# Altium schematic sheet Sch.SchDoc
size A1
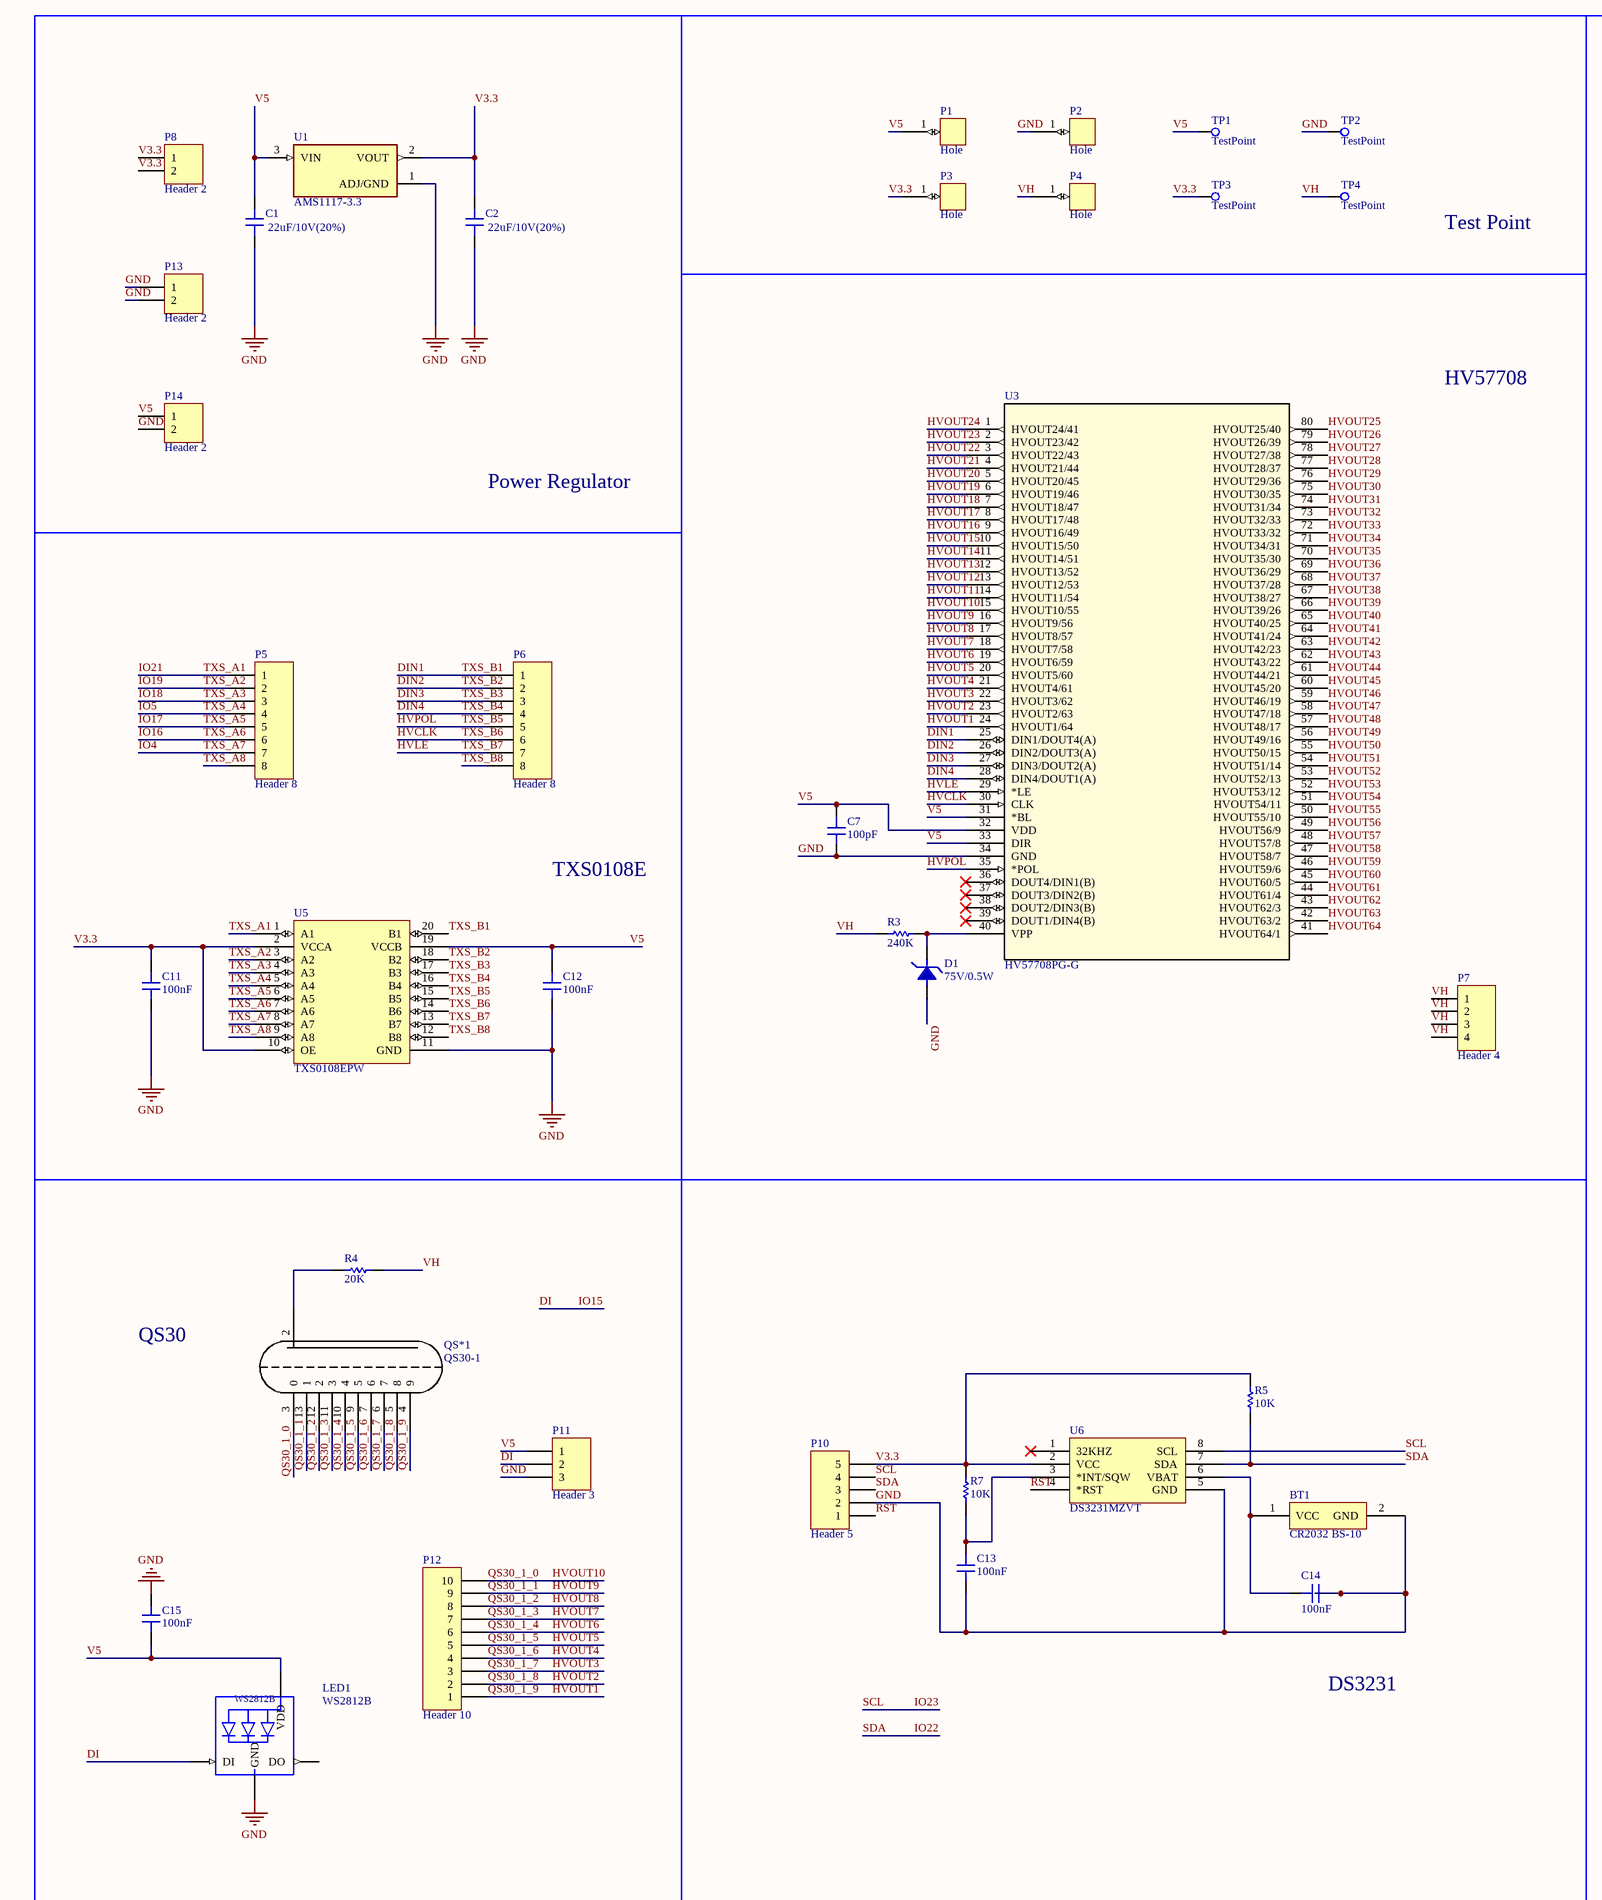
[diagram p0: Sch.SchDoc, left]
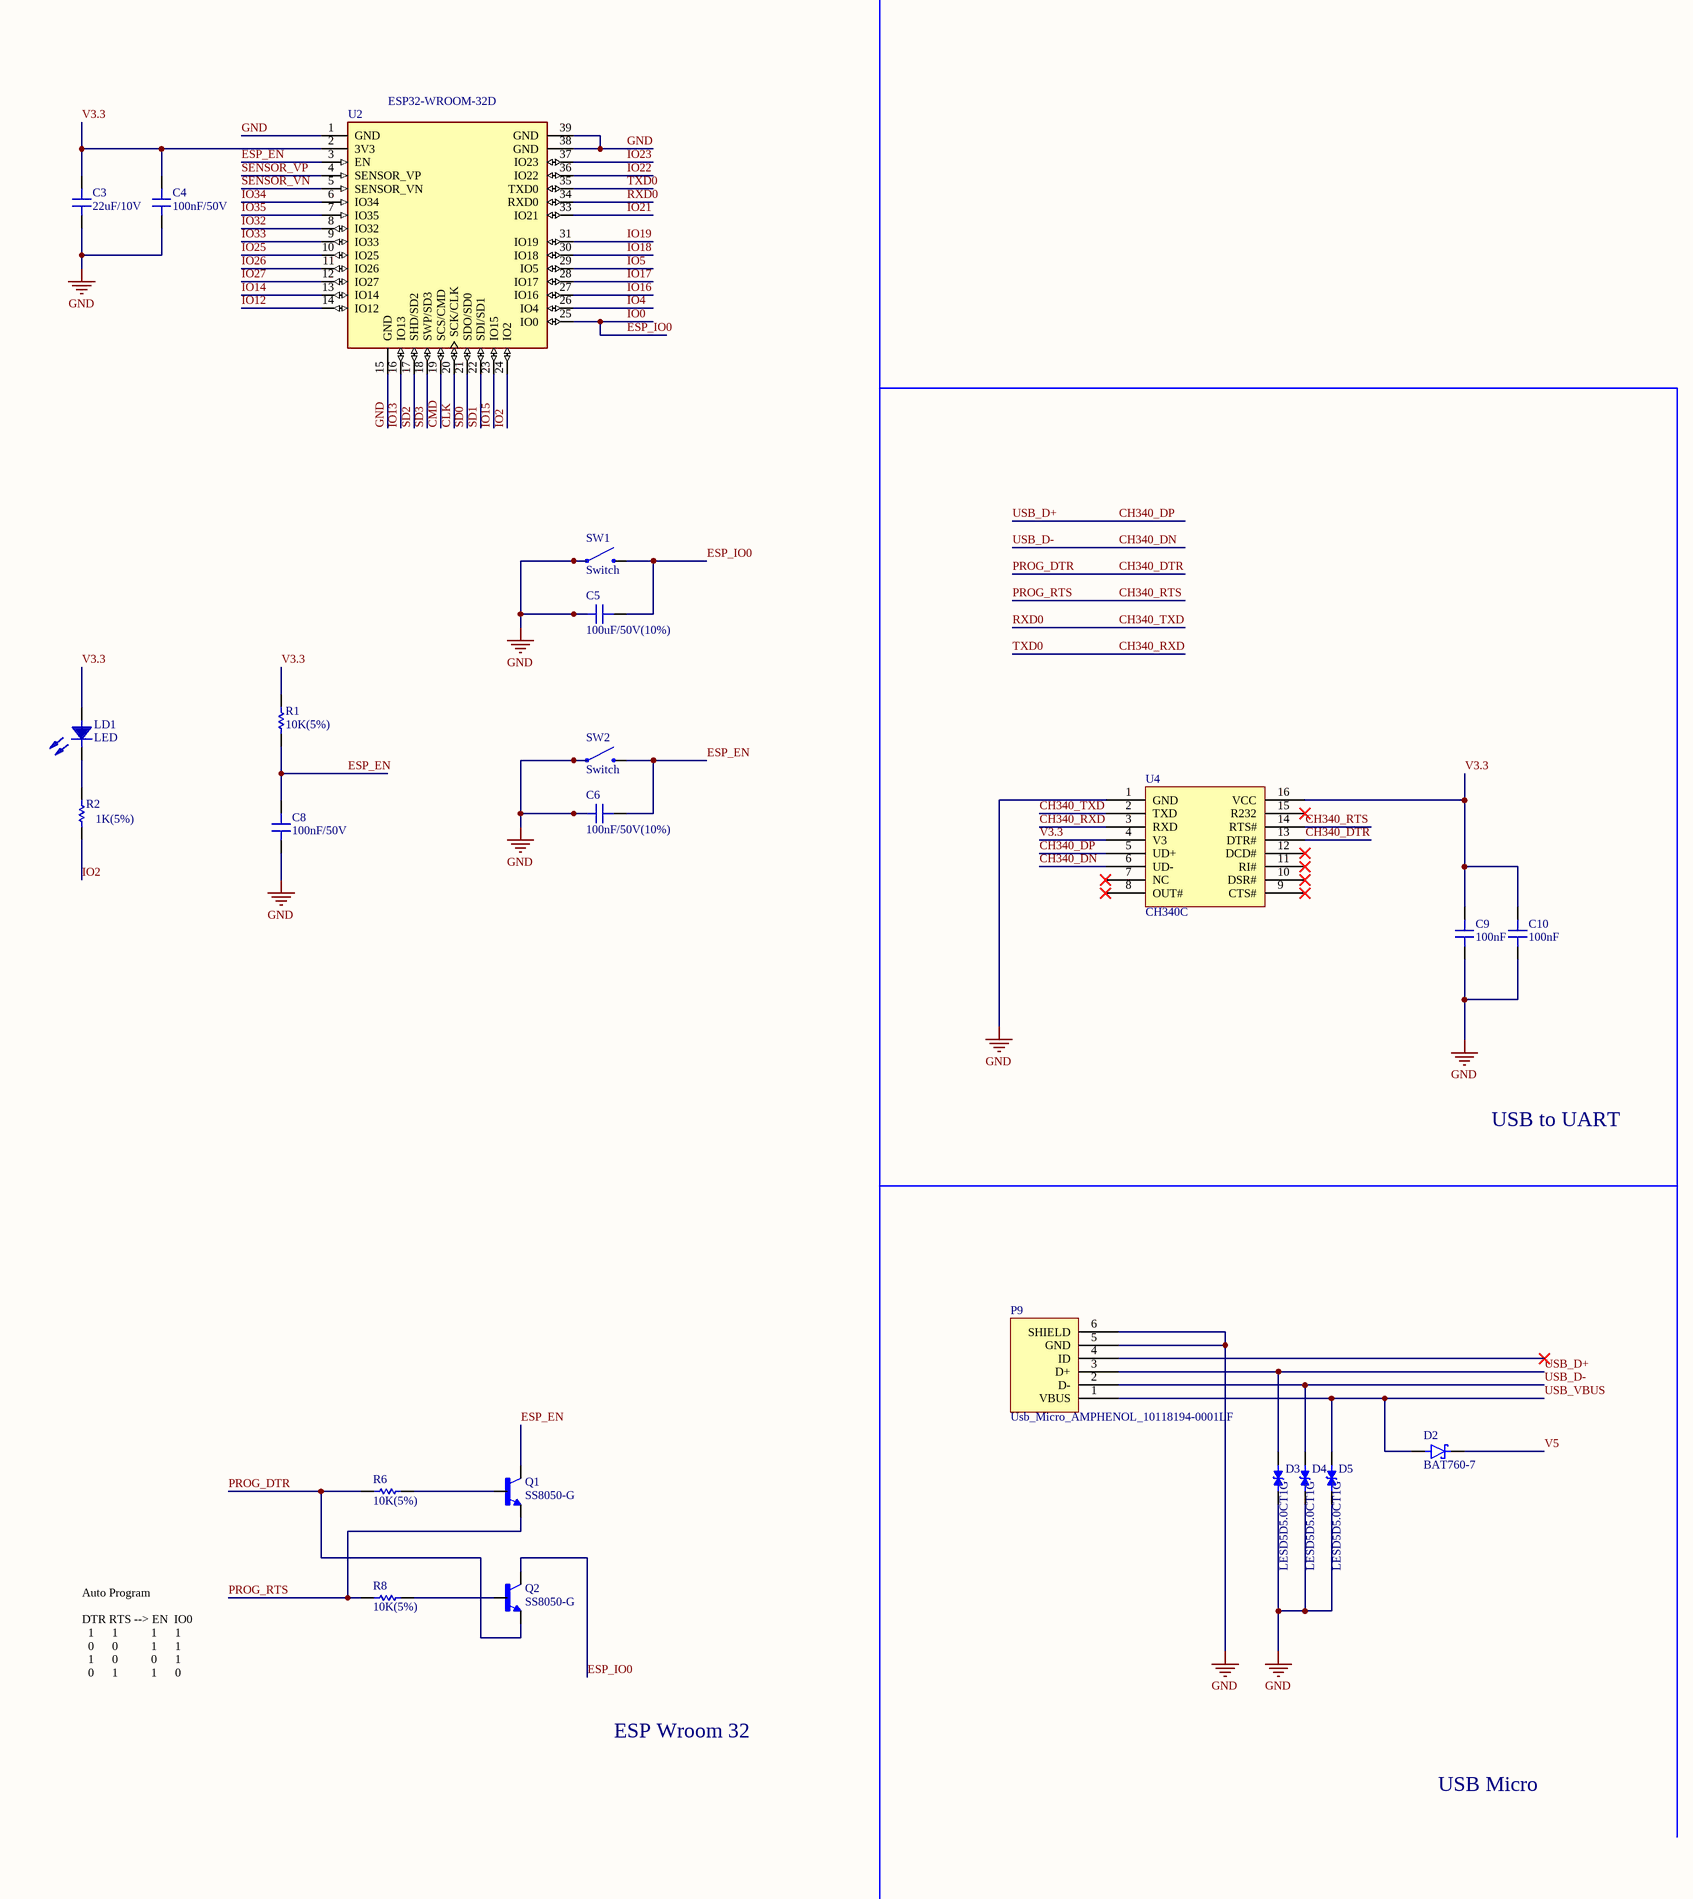
[diagram p1: Sch.SchDoc, right]

## Parts
BT1  CR2032 BS-10  [CR2032 BS-10]
C1  22uF/10V(20%)  [0805]
C2  22uF/10V(20%)  [0805]
C3  22uF/10V  [0805]
C4  100nF/50V  [0805]
C5  100uF/50V(10%)  [0805]
C6  100nF/50V(10%)  [0805]
C7  100pF  [0805]
C8  100nF/50V  [0805]
C9  100nF  [0805]
C10  100nF  [0805]
C11  100nF  [0805]
C12  100nF  [0805]
C13  100nF  [0805]
C14  100nF  [0805]
C15  100nF  [0805]
D1  75V/0.5W  [1206 Semiconductor]
D2  BAT760-7  [BAT760-7_SOD2513X120N]
D3  LESD5D5.0CT1G  [TVS_LESD5D5.0CT1G]
D4  LESD5D5.0CT1G  [TVS_LESD5D5.0CT1G]
D5  LESD5D5.0CT1G  [TVS_LESD5D5.0CT1G]
LD1  LED  [0805 Semiconductor]
LED1  WS2812B  [WS2812B]
P1  Hole  [HOLE_1M2]
P2  Hole  [HOLE_1M2]
P3  Hole  [HOLE_1M2]
P4  Hole  [HOLE_1M2]
P5  Header 8  [HDR1X8]
P6  Header 8  [HDR1X8]
P7  Header 4  [HDR1X4]
P8  Header 2  [HDR1X2]
P9  Usb_Micro_AMPHENOL_10118194-0001LF  [USB_MICRO_AMPHENOL_10118194-0001LF]
P10  Header 5  [HDR1X5]
P11  Header 3  [HDR1X3]
P12  Header 10  [HDR1X10]
P13  Header 2  [HDR1X2]
P14  Header 2  [HDR1X2]
Q1  SS8050-G  [TRANS_SS8050-G]
Q2  SS8050-G  [TRANS_SS8050-G]
QS*1  QS30-1  [QS30-1]
R1  10K(5%)  [0805]
R2  1K(5%)  [0805]
R3  240K  [0805]
R4  20K  [0805]
R5  10K  [0805]
R6  10K(5%)  [0805]
R7  10K  [0805]
R8  10K(5%)  [0805]
SW1  Switch  [2917]
SW2  Switch  [2917]
TP1  TestPoint  [Test-Point-SMD]
TP2  TestPoint  [Test-Point-SMD]
TP3  TestPoint  [Test-Point-SMD]
TP4  TestPoint  [Test-Point-SMD]
U1  AMS1117-3.3  [AMS1117_3V3_SOT229P700X180-4N]
U2  ESP32-WROOM-32D  [ESP32-WROOM-32D]
U3  HV57708PG-G  [HV57708]
U4  CH340C  [CH340C_SOIC127P600X180-16N]
U5  TXS0108EPW  [TXS0108EPW]
U6  DS3231MZVT  [DS3231]

## Nets
GND: BT1.2(GND) C1.2 C2.2 C3.1 C4.1 C5.1 C6.1 C7.1 C8.1 C9.1 C10.1 C11.1 C12.1 C13.1 C14.1 C15.1 D1.2 D3.1 D4.1 D5.1 LED1.3-GND(GND) P2.1 P9.5(GND) P9.6(SHIELD) P10.2 P11.3 P13.1 P13.2 P14.2 SW1.1 SW2.1 TP2.1 U1.1(ADJ/GND) U2.1(GND) U2.15(GND) U2.38(GND) U2.39(GND) U3.34(GND) U4.1(GND) U5.11(GND) U6.5(GND)
CH340_DN: D4.2 P9.2(D-) U4.6(UD-)  [also labelled USB_D-]
CH340_DP: D3.2 P9.3(D+) U4.5(UD+)  [also labelled USB_D+]
CH340_DTR: Q2.2(E) R6.1 U4.13(DTR#)  [also labelled PROG_DTR]
CH340_RTS: Q1.2(E) R8.1 U4.14(RTS#)  [also labelled PROG_RTS]
CH340_RXD: U2.35(TXD0) U4.3(RXD)  [also labelled TXD0]
CH340_TXD: U2.34(RXD0) U4.2(TXD)  [also labelled RXD0]
CLK: U2.20(SCK/CLK)
CMD: U2.19(SCS/CMD)
DI: LED1.4-DIN(DI) P11.2 U2.23(IO15)  [also labelled IO15]
DIN1: P6.1 U3.25(DIN1/DOUT4(A)) U5.20(B1)  [also labelled TXS_B1]
DIN2: P6.2 U3.26(DIN2/DOUT3(A)) U5.18(B2)  [also labelled TXS_B2]
DIN3: P6.3 U3.27(DIN3/DOUT2(A)) U5.17(B3)  [also labelled TXS_B3]
DIN4: P6.4 U3.28(DIN4/DOUT1(A)) U5.16(B4)  [also labelled TXS_B4]
ESP_EN: C6.2 C8.2 Q1.3(C) R1.2 SW2.2 U2.3(EN)
ESP_IO0: C5.2 Q2.3(C) SW1.2 U2.25(IO0)  [also labelled IO0]
HVCLK: P6.6 U3.30(CLK) U5.14(B6)  [also labelled TXS_B6]
HVLE: P6.7 U3.29(*LE) U5.13(B7)  [also labelled TXS_B7]
HVOUT1: P12.1 QS*1.4(9) U3.24(HVOUT1/64)  [also labelled QS30_1_9]
HVOUT2: P12.2 QS*1.5(8) U3.23(HVOUT2/63)  [also labelled QS30_1_8]
HVOUT3: P12.3 QS*1.6(7) U3.22(HVOUT3/62)  [also labelled QS30_1_7]
HVOUT4: P12.4 QS*1.7(6) U3.21(HVOUT4/61)  [also labelled QS30_1_6]
HVOUT5: P12.5 QS*1.9(5) U3.20(HVOUT5/60)  [also labelled QS30_1_5]
HVOUT6: P12.6 QS*1.10(4) U3.19(HVOUT6/59)  [also labelled QS30_1_4]
HVOUT7: P12.7 QS*1.11(3) U3.18(HVOUT7/58)  [also labelled QS30_1_3]
HVOUT8: P12.8 QS*1.12(2) U3.17(HVOUT8/57)  [also labelled QS30_1_2]
HVOUT9: P12.9 QS*1.13(1) U3.16(HVOUT9/56)  [also labelled QS30_1_1]
HVOUT10: P12.10 QS*1.3(0) U3.15(HVOUT10/55)  [also labelled QS30_1_0]
HVOUT11: U3.14(HVOUT11/54)
HVOUT12: U3.13(HVOUT12/53)
HVOUT13: U3.12(HVOUT13/52)
HVOUT14: U3.11(HVOUT14/51)
HVOUT15: U3.10(HVOUT15/50)
HVOUT16: U3.9(HVOUT16/49)
HVOUT17: U3.8(HVOUT17/48)
HVOUT18: U3.7(HVOUT18/47)
HVOUT19: U3.6(HVOUT19/46)
HVOUT20: U3.5(HVOUT20/45)
HVOUT21: U3.4(HVOUT21/44)
HVOUT22: U3.3(HVOUT22/43)
HVOUT23: U3.2(HVOUT23/42)
HVOUT24: U3.1(HVOUT24/41)
HVOUT25: U3.80(HVOUT25/40)
HVOUT26: U3.79(HVOUT26/39)
HVOUT27: U3.78(HVOUT27/38)
HVOUT28: U3.77(HVOUT28/37)
HVOUT29: U3.76(HVOUT29/36)
HVOUT30: U3.75(HVOUT30/35)
HVOUT31: U3.74(HVOUT31/34)
HVOUT32: U3.73(HVOUT32/33)
HVOUT33: U3.72(HVOUT33/32)
HVOUT34: U3.71(HVOUT34/31)
HVOUT35: U3.70(HVOUT35/30)
HVOUT36: U3.69(HVOUT36/29)
HVOUT37: U3.68(HVOUT37/28)
HVOUT38: U3.67(HVOUT38/27)
HVOUT39: U3.66(HVOUT39/26)
HVOUT40: U3.65(HVOUT40/25)
HVOUT41: U3.64(HVOUT41/24)
HVOUT42: U3.63(HVOUT42/23)
HVOUT43: U3.62(HVOUT43/22)
HVOUT44: U3.61(HVOUT44/21)
HVOUT45: U3.60(HVOUT45/20)
HVOUT46: U3.59(HVOUT46/19)
HVOUT47: U3.58(HVOUT47/18)
HVOUT48: U3.57(HVOUT48/17)
HVOUT49: U3.56(HVOUT49/16)
HVOUT50: U3.55(HVOUT50/15)
HVOUT51: U3.54(HVOUT51/14)
HVOUT52: U3.53(HVOUT52/13)
HVOUT53: U3.52(HVOUT53/12)
HVOUT54: U3.51(HVOUT54/11)
HVOUT55: U3.50(HVOUT55/10)
HVOUT56: U3.49(HVOUT56/9)
HVOUT57: U3.48(HVOUT57/8)
HVOUT58: U3.47(HVOUT58/7)
HVOUT59: U3.46(HVOUT59/6)
HVOUT60: U3.45(HVOUT60/5)
HVOUT61: U3.44(HVOUT61/4)
HVOUT62: U3.43(HVOUT62/3)
HVOUT63: U3.42(HVOUT63/2)
HVOUT64: U3.41(HVOUT64/1)
HVPOL: P6.5 U3.35(*POL) U5.15(B5)  [also labelled TXS_B5]
IO2: R2.1 U2.24(IO2)
IO4: P5.7 U2.26(IO4) U5.8(A7)  [also labelled TXS_A7]
IO5: P5.4 U2.29(IO5) U5.5(A4)  [also labelled TXS_A4]
IO12: U2.14(IO12)
IO13: U2.16(IO13)
IO14: U2.13(IO14)
IO16: P5.6 U2.27(IO16) U5.7(A6)  [also labelled TXS_A6]
IO17: P5.5 U2.28(IO17) U5.6(A5)  [also labelled TXS_A5]
IO18: P5.3 U2.30(IO18) U5.4(A3)  [also labelled TXS_A3]
IO19: P5.2 U2.31(IO19) U5.3(A2)  [also labelled TXS_A2]
IO21: P5.1 U2.33(IO21) U5.1(A1)  [also labelled TXS_A1]
IO22: P10.3 R5.1 U2.36(IO22) U6.7(SDA)  [also labelled SDA]
IO23: P10.4 U2.37(IO23) U6.8(SCL)  [also labelled SCL]
IO25: U2.10(IO25)
IO26: U2.11(IO26)
IO27: U2.12(IO27)
IO32: U2.8(IO32)
IO33: U2.9(IO33)
IO34: U2.6(IO34)
IO35: U2.7(IO35)
RST: P10.1 U6.4(*RST)
SD0: U2.21(SDO/SD0)
SD1: U2.22(SDI/SD1)
SD2: U2.17(SHD/SD2)
SD3: U2.18(SWP/SD3)
SENSOR_VN: U2.5(SENSOR_VN)
SENSOR_VP: U2.4(SENSOR_VP)
TXS_A8: P5.8 U5.9(A8)
TXS_B8: P6.8 U5.12(B8)
USB_VBUS: D2.A D5.2 P9.1(VBUS)
V3.3: C2.1 C3.2 C4.2 C9.2 C10.2 C11.2 LD1.2 P3.1 P8.1 P8.2 P10.5 R1.1 R5.2 R7.2 TP3.1 U1.2(VOUT) U2.2(3V3) U4.4(V3) U4.16(VCC) U5.2(VCCA) U5.10(OE) U6.2(VCC)
V5: C1.1 C7.2 C12.2 C15.2 D2.C(K) LED1.1-VDD(VDD) P1.1 P11.1 P14.1 TP1.1 U1.3(VIN) U3.31(*BL) U3.32(VDD) U3.33(DIR) U5.19(VCCB)
VH: P4.1 P7.1 P7.2 P7.3 P7.4 R3.1 R4.2 TP4.1
NetBT1_1: BT1.1(VCC) C14.2 U6.6(VBAT)
NetC13_2: C13.2 R7.1 U6.3(*INT/SQW)
NetD1_1: D1.1 R3.2 U3.40(VPP)
NetLD1_1: LD1.1 R2.2
NetQ1_1: Q1.1(B) R6.2
NetQ2_1: Q2.1(B) R8.2
NetQS*1_2: QS*1.2 R4.1

Not connected (* = marked no-connect by the designer): LED1 2-DOUT(DO); P9 4(ID)*; U3 36(DOUT4/DIN1(B))* 37(DOUT3/DIN2(B))* 38(DOUT2/DIN3(B))* 39(DOUT1/DIN4(B))*; U4 7(NC)* 8(OUT#)* 9(CTS#)* 10(DSR#)* 11(RI#)* 12(DCD#)* 15(R232)*; U6 1(32KHZ)*

## Notes on the sheet
- Test Point
- HV57708
- Power Regulator
- TXS0108E
- USB to UART
- QS30
- DS3231
- Auto Program
  DTR RTS --> EN  IO0
  1      1           1      1
  0      0           1      1
  1      0           0      1
  0      1           1      0
- ESP Wroom 32
- USB Micro

## Library data of the parts
C1-C15 = Capacitor
D1 = DiodeZener
D2 = BAT760-7: Diode Schottky 30V 1A 2-Pin SOD-323 T/R; MF: Diodes Zetex; MP: BAT760-7; SnapEDA_Link: https://www.snapeda.com/parts/BAT760-7/Zetex/view-part/4817231/?ref=snap; Value: *; DigiKey-Purchase-URL: https://snapeda.com/shop?store=DigiKey&id=4817231; Package: None; Mouser-Purchase-URL: https://snapeda.com/shop?store=Mouser&id=4817231; Price: None; Availability: Good
D3-D5 = LESD5D5.0CT1G: Transient Voltage Suppressors for ESD Protection; MF: Leshan Radio Co.; Value: *; SnapEDA_Link: https://www.snapeda.com/parts/LESD5D5.0CT1G/Leshan+Radio+Co./view-part/?ref=snap; MP: LESD5D5.0CT1G; Check_prices: https://www.snapeda.com/parts/LESD5D5.0CT1G/Leshan+Radio+Co./view-part/?ref=eda; Availability: Not in stock; Price: None; Package: None
LED1 = WS2812B: Raspberry Pi HAT _40 pin_ Wheeled Robotics Kit; MF: SparkFun Electronics; Availability: Unavailable; SnapEDA_Link: https://www.snapeda.com/parts/WS2812B/Worldsemi/view-part/1038297/?ref=snap; MP: WS2812B; Price: None; Value: *; Package: None
P5 P6 = Header 8: Header, 8-Pin; LatestRevisionDate: 17-Jul-2002; LatestRevisionNote: Re-released for DXP Platform.; Publisher: Altium Limited
P7 = Header 4: Header, 4-Pin; LatestRevisionDate: 17-Jul-2002; LatestRevisionNote: Re-released for DXP Platform.; Publisher: Altium Limited
P8 P13 P14 = Header 2: Header, 2-Pin; LatestRevisionDate: 17-Jul-2002; LatestRevisionNote: Re-released for DXP Platform.; Publisher: Altium Limited
P9 = Usb_Micro
P10 = Header 5: Header, 5-Pin; LatestRevisionDate: 17-Jul-2002; LatestRevisionNote: Re-released for DXP Platform.; Publisher: Altium Limited
P11 = Header 3: Header, 3-Pin; LatestRevisionDate: 17-Jul-2002; LatestRevisionNote: Re-released for DXP Platform.; Publisher: Altium Limited
P12 = Header 10: Header, 10-Pin; LatestRevisionDate: 17-Jul-2002; LatestRevisionNote: Re-released for DXP Platform.; Publisher: Altium Limited
Q1 Q2 = SS8050-G: Bipolar (BJT) Transistor NPN 25 V 1.5 A 100MHz 300 mW Surface Mount SOT-23-3; MF: Comchip Technology; SnapEDA_Link: https://www.snapeda.com/parts/SS8050-G/Comchip+Technology/view-part/?ref=snap; Purchase-URL: https://pricing.snapeda.com/search/part/SS8050-G/?ref=eda; Availability: In Stock; Price: None; Package: TO-236-3 Comchip Technology; Check_prices: https://www.snapeda.com/parts/SS8050-G/Comchip+Technology/view-part/?ref=eda; Value: *; MP: SS8050-G
R1-R8 = Resistor
SW1 SW2 = Switch: Resistor
U1 = AMS1117-3.3: Sot223/Pkg 1-Amp 3.3-Volt Low Drop Out Voltage Regulatator; MF: Advanced Monolithic Systems; Price: None; Package: None; Value: *; MP: AMS1117-3.3; Availability: Unavailable; SnapEDA_Link: https://www.snapeda.com/parts/AMS1117-3.3/Advanced%20Monolithic%20Systems/view-part/53450/?ref=snap
U2 = ESP32-WROOM-32D: Bluetooth, WiFi 802.11b/g/n, Bluetooth v4.2 + EDR, Class 1, 2 and 3 Transceiver Module 2.4GHz ~ 2.5GHz Integrated, Trace Surface Mount; MF: Espressif Systems; Price: None; Package: Module Espressif Systems; Availability: Unavailable; SnapEDA_Link: https://www.snapeda.com/parts/ESP32-WROOM-32D/Espressif%20Systems/view-part/2768115/?ref=snap; Value: *; MP: ESP32-WROOM-32D
U3 = HV57708PG-G: No Description Available; Mfr_Name: Microchip; RefDes: RefDes; Type: Type
U6 = DS3231MZVT: Real Time Clock _RTC_ IC Clock/Calendar IÂ²C, 2-Wire Serial 8-SOIC _0.154, 3.90mm Width_; MF: Maxim Integrated; MP: DS3231MZ/V+T; Digi-Key_Part_Number: DS3231MZ/V+TTR-ND; Digi-Key_Purchase_URL: https://www.digikey.com/product-detail/en/maxim-integrated/DS3231MZ-V-T/DS3231MZ-V-TTR-ND/3440500?utm_source=snapeda&utm_medium=aggregator&utm_campaign=symbol; SnapEDA_Link: https://www.snapeda.com/parts/DS3231MZ/V+T/Maxim%20Integrated/view-part/230018/?ref=snap; Package: SOIC-8 Maxim Integrated; Value: *